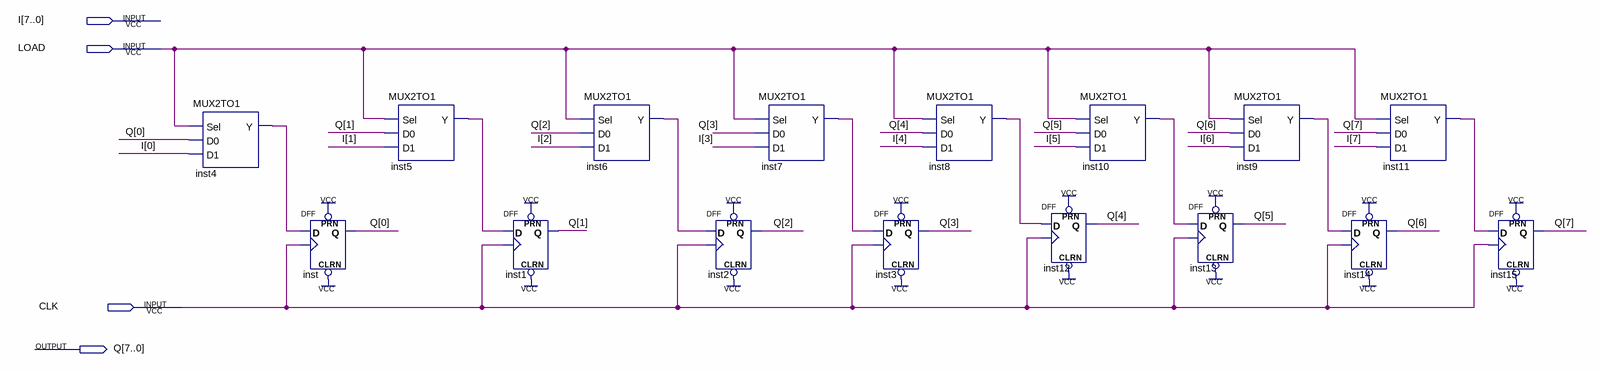
[diagram p0: schematic sheet]
// Quartus schematic Reg.bdf as structural Verilog: 16 symbols, 4 pins
module Reg (
  input  [7:0] I,
  input  LOAD,
  input  CLK,
  output [7:0] Q
);

  wire inst4_y, inst5_y, inst6_y, inst7_y, inst8_y, inst9_y, inst10_y, inst11_y;

  MUX2TO1 inst4 (.Sel(LOAD), .D0(Q[0]), .D1(I[0]), .Y(inst4_y));
  DFF inst (.CLRN(1'b1), .CLK(CLK), .D(inst4_y), .PRN(1'b1), .Q(Q[0]));
  MUX2TO1 inst5 (.Sel(LOAD), .D0(Q[1]), .D1(I[1]), .Y(inst5_y));
  DFF inst1 (.CLRN(1'b1), .CLK(CLK), .D(inst5_y), .PRN(1'b1), .Q(Q[1]));
  MUX2TO1 inst6 (.Sel(LOAD), .D0(Q[2]), .D1(I[2]), .Y(inst6_y));
  DFF inst2 (.CLRN(1'b1), .CLK(CLK), .D(inst6_y), .PRN(1'b1), .Q(Q[2]));
  MUX2TO1 inst7 (.Sel(LOAD), .D0(Q[3]), .D1(I[3]), .Y(inst7_y));
  DFF inst3 (.CLRN(1'b1), .CLK(CLK), .D(inst7_y), .PRN(1'b1), .Q(Q[3]));
  MUX2TO1 inst8 (.Sel(LOAD), .D0(Q[4]), .D1(I[4]), .Y(inst8_y));
  DFF inst12 (.CLRN(1'b1), .CLK(CLK), .D(inst8_y), .PRN(1'b1), .Q(Q[4]));
  MUX2TO1 inst10 (.Sel(LOAD), .D0(Q[5]), .D1(I[5]), .Y(inst10_y));
  DFF inst13 (.CLRN(1'b1), .CLK(CLK), .D(inst10_y), .PRN(1'b1), .Q(Q[5]));
  MUX2TO1 inst9 (.Sel(LOAD), .D0(Q[6]), .D1(I[6]), .Y(inst9_y));
  MUX2TO1 inst11 (.Sel(LOAD), .D0(Q[7]), .D1(I[7]), .Y(inst11_y));
  DFF inst14 (.CLRN(1'b1), .CLK(CLK), .D(inst9_y), .PRN(1'b1), .Q(Q[6]));
  DFF inst15 (.CLRN(1'b1), .CLK(CLK), .D(inst11_y), .PRN(1'b1), .Q(Q[7]));
endmodule
